# Altium schematic sheet QUTMS-BrakeLight-S01.SchDoc: LED Driver
size A3; Author: Joseph Richards; DrawnBy: Joseph Richards; Engineer: Joseph Richards; Organization: QUTMS; DocumentNumber: 2; Revision: 1; SheetNumber: 2; SheetTotal: 3
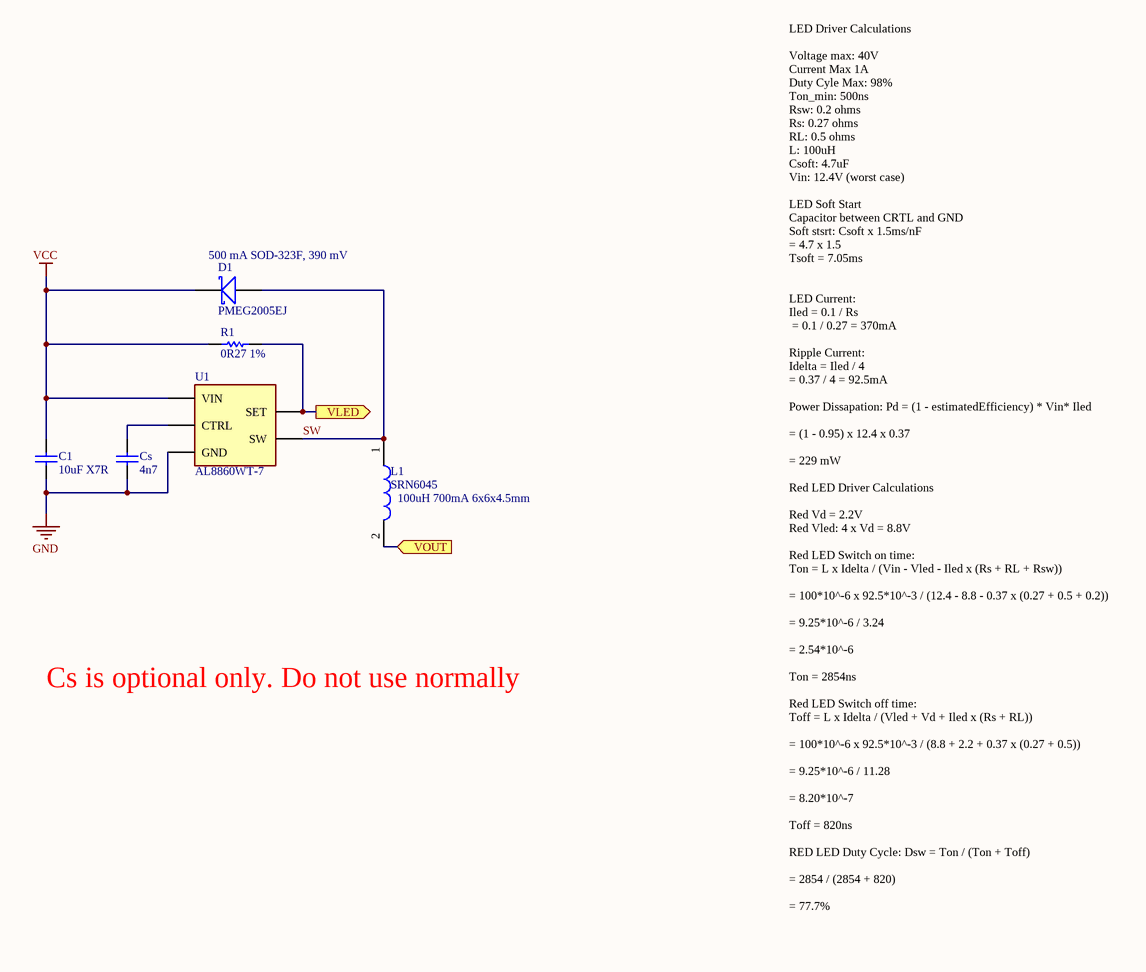
[diagram p0: QUTMS-BrakeLight-S01.SchDoc]

## Parts
C1  10uF X7R  [Cap_Ceramic_0603]
Cs  4n7  [Cap_Ceramic_0603]
D1  PMEG2005EJ  [SOD-323F]
L1  SRN6045  [Bourns Inductor 6x6x4.5mm]
R1  0R27 1%  [Res_ThinFilm_0603]
U1  AL8860WT-7  [TSOT-25]

## Ports
VLED (out), VOUT (in)

## Nets
GND: C1.1 Cs.1 U1.2(GND)
VCC: C1.2 D1.K(Cathode) R1.1 U1.5(VIN)
SW: D1.A(Anode) L1.1 U1.1(SW)
VLED: R1.2 U1.4(SET) ; port VLED
VOUT: L1.2 ; port VOUT
NetCs_2: Cs.2 U1.3(CTRL)

## Notes on the sheet
- (near D1) 500 mA SOD-323F, 390 mV
- (near L1) 100uH 700mA 6x6x4.5mm
- Cs is optional only. Do not use normally
- LED Driver Calculations
  Voltage max: 40V
  Current Max 1A
  Duty Cyle Max: 98%
  Ton_min: 500ns
  Rsw: 0.2 ohms
  Rs: 0.27 ohms
  RL: 0.5 ohms
  L: 100uH
  Csoft: 4.7uF
  Vin: 12.4V (worst case)
  LED Soft Start
  Capacitor between CRTL and GND
  Soft stsrt: Csoft x 1.5ms/nF
  = 4.7 x 1.5
  Tsoft = 7.05ms
  LED Current:
  Iled = 0.1 / Rs
  = 0.1 / 0.27 = 370mA
  Ripple Current:
  Idelta = Iled / 4
  = 0.37 / 4 = 92.5mA
  Power Dissapation: Pd = (1 - estimatedEfficiency) * Vin* Iled
  = (1 - 0.95) x 12.4 x 0.37
  = 229 mW
  Red LED Driver Calculations
  Red Vd = 2.2V
  Red Vled: 4 x Vd = 8.8V
  Red LED Switch on time:
  Ton = L x Idelta / (Vin - Vled - Iled x (Rs + RL + Rsw))
  = 100*10^-6 x 92.5*10^-3 / (12.4 - 8.8 - 0.37 x (0.27 + 0.5 + 0.2))
  = 9.25*10^-6 / 3.24
  = 2.54*10^-6
  Ton = 2854ns
  Red LED Switch off time:
  Toff = L x Idelta / (Vled + Vd + Iled x (Rs + RL))
  = 100*10^-6 x 92.5*10^-3 / (8.8 + 2.2 + 0.37 x (0.27 + 0.5))
  = 9.25*10^-6 / 11.28
  = 8.20*10^-7
  Toff = 820ns
  RED LED Duty Cycle: Dsw = Ton / (Ton + Toff)
  = 2854 / (2854 + 820)
  = 77.7%
- Revision History:
- Sheet Title:
- Rev
- Date
- Description
- Project:
- Size:
- Drawn By:
- A3
- Number:
- Revision:
- Sheet
- Version:
- of
- QUT Motorsport
- O-120, Gardens Point
- 2 George Street
- Brisbane, QLD 4000
- Australia
- Print Date:
- Print Time:
- File Name:

## Library data of the parts
C1 = 10uF 50V 5% X7R 0603: Capacitor, Ceramic, SMD, 10uF, 50V, 5%, X7R, 0603
Cs = 4n7 25V 5% X7R 0603: Capacitor, Ceramic, SMD, 4n7, 25V, 5%, X7R, 0603
D1 = PMEG2005EJ: PMEG2005EJ,115 -  Schottky Rectifier, 20 V, 500 mA, Single, SOD-323F, 2 Pins, 390 mV; ComponentLink1Description: Element14; ComponentLink1URL: https://au.element14.com/nexperia/pmeg2005ej-115/schottky-rect-20v-0-5a-sod323f/dp/1757760
L1 = SRN6045: Power Inductor (SMD), 100 µH, 700 mA, Semishielded, 800 mA; ComponentLink1Description: Element14; ComponentLink1URL: https://au.element14.com/bourns/srn6045-101m/inductor-100uh-semi-shielded-power/dp/2061658
R1 = 0R27 1% 0603: ERJ3RQFR27V - SMD Current Sense Resistor, 0273 ohm, ERJ3R Series, 0603 [1608 Metric], 100 mW, ± 1%, Thick Film; ComponentLink1Description: Element14; ComponentLink1URL: https://au.element14.com/tt-electronics-welwyn/lcs0603-r30ft5/current-sense-res-0r3-1-100-mw/dp/2663681
U1 = AL8860WT-7: AL8860WT-7 -  LED Driver, 1 Output, Buck (Step Down), 4.5 V to 40 V in, 1 MHz switch, PWM, 40V/1 A out, TSOT-25-5